# EAGLE schematic deneme4 (EAGLE 9.6.2)
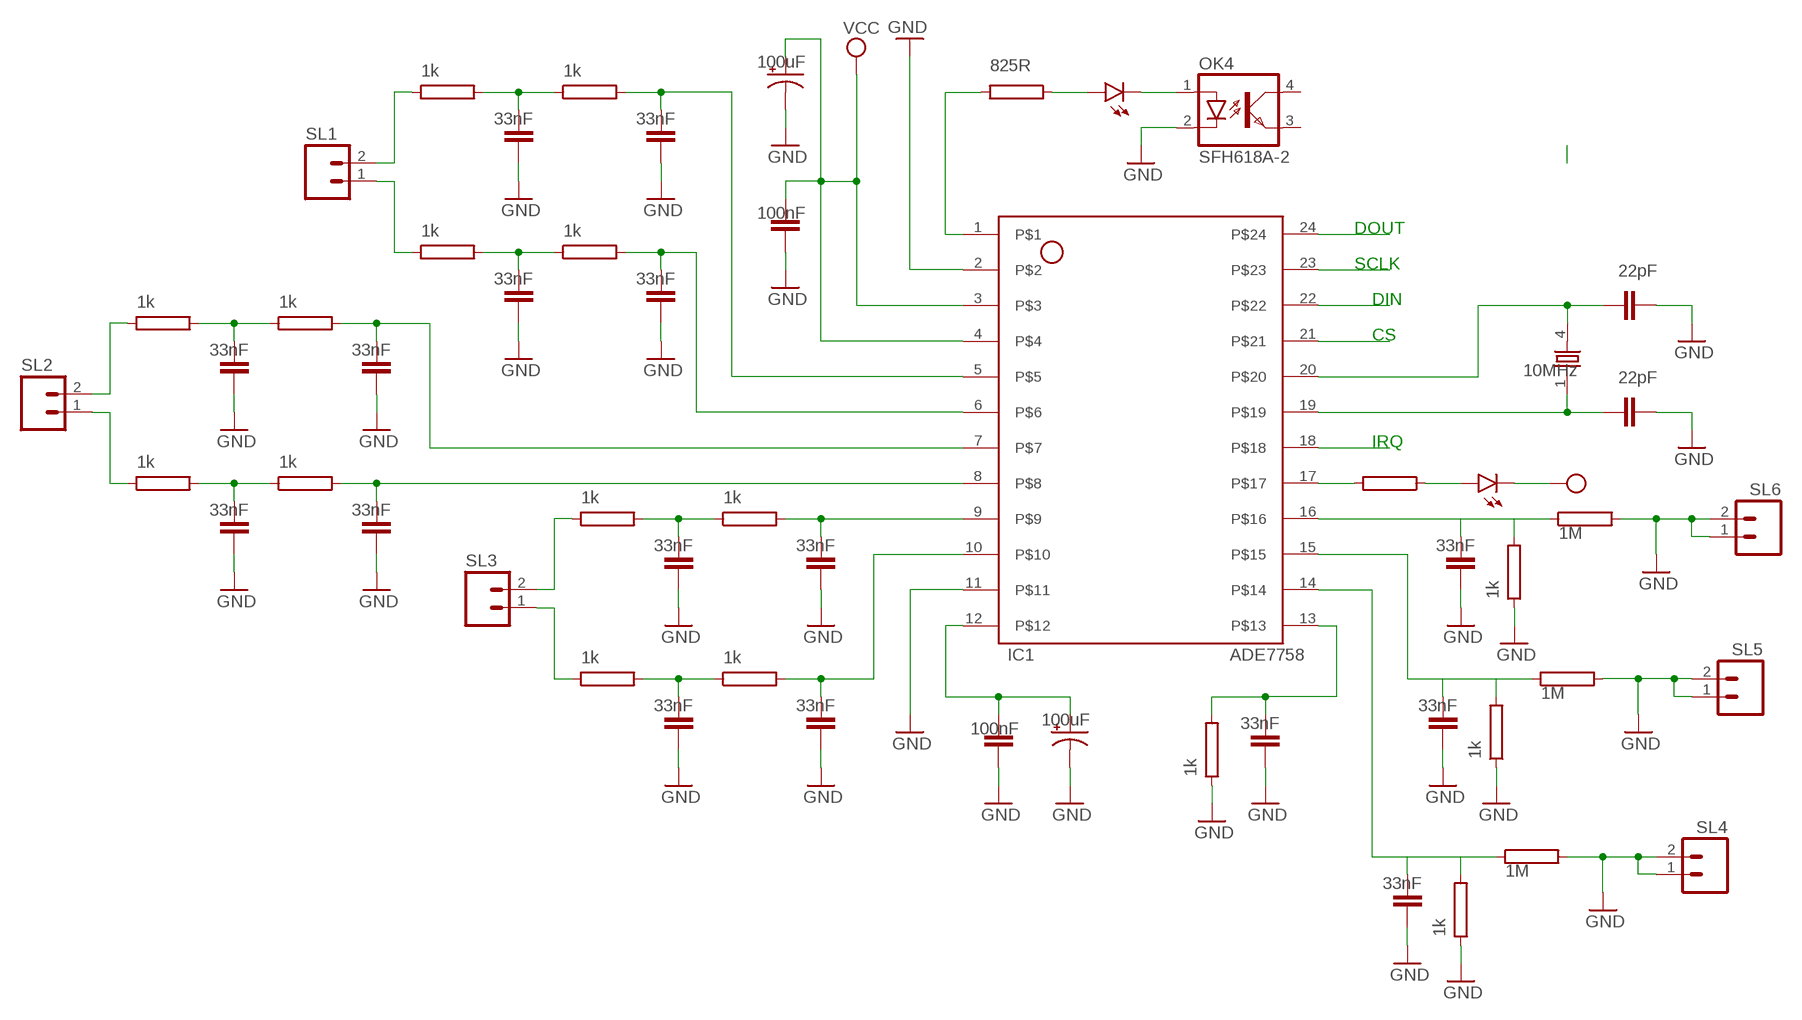
[diagram p0: schematic, sheet 1]

## Parts
C1  100nF  C2,5-3  [C2.5-3]
C2  33nF  C2,5-3  [C2.5-3]
C4  33nF  C2,5-3  [C2.5-3]
C5  33nF  C2,5-3  [C2.5-3]
C6  33nF  C2,5-3  [C2.5-3]
C7  33nF  C2,5-3  [C2.5-3]
C8  22pF  C2,5-3  [C2.5-3]
C9  22pF  C2,5-3  [C2.5-3]
C14  100uF  CPOL-US085CS-1AR  [085CS_1AR]
C16  33nF  C2,5-3  [C2.5-3]
C17  33nF  C2,5-3  [C2.5-3]
C18  33nF  C2,5-3  [C2.5-3]
C19  33nF  C2,5-3  [C2.5-3]
C20  33nF  C2,5-3  [C2.5-3]
C21  33nF  C2,5-3  [C2.5-3]
C22  33nF  C2,5-3  [C2.5-3]
C23  100uF  CPOL-US085CS-1AR  [085CS_1AR]
C24  100nF  C2,5-3  [C2.5-3]
C25  33nF  C2,5-3  [C2.5-3]
C26  33nF  C2,5-3  [C2.5-3]
C27  33nF  C2,5-3  [C2.5-3]
C28  33nF  C2,5-3  [C2.5-3]
IC1  ADE7758  [ADE7758ARWZ]
LED1  LAP4-BOTTOM  [P47F-BOTTOM]
LED2  LAP4-BOTTOM  [P47F-BOTTOM]
OK4  SFH618A-2  [DIP4]
Q1  10MHz  86SMX  [86SMX]
R1  825R  RMG100-V  [TO-247-2V]
R2  1k  RMG100-V  [TO-247-2V]
R3  1k  RMG100-V  [TO-247-2V]
R4  1k  RMG100-V  [TO-247-2V]
R5  1k  RMG100-V  [TO-247-2V]
R6  1k  RMG100-V  [TO-247-2V]
R7  1k  RMG100-V  [TO-247-2V]
R8  1k  RMG100-V  [TO-247-2V]
R9  1k  RMG100-V  [TO-247-2V]
R10  1k  RMG100-V  [TO-247-2V]
R11  1k  RMG100-V  [TO-247-2V]
R12  1k  RMG100-V  [TO-247-2V]
R13  1k  RMG100-V  [TO-247-2V]
R14  1k  RMG100-V  [TO-247-2V]
R15  1k  RMG100-V  [TO-247-2V]
R16  1M  RMG100-V  [TO-247-2V]
R17  1k  RMG100-V  [TO-247-2V]
R18  1M  RMG100-V  [TO-247-2V]
R19  1k  RMG100-V  [TO-247-2V]
R20  1M  RMG100-V  [TO-247-2V]
R21  825R  RMG100-V  [TO-247-2V]
SL1  M02  [02P]
SL2  M02  [02P]
SL3  M02  [02P]
SL4  M02  [02P]
SL5  M02  [02P]
SL6  M02  [02P]

## Nets
GND: C1.1 C2.2 C4.2 C5.2 C6.2 C7.2 C8.2 C9.2 C14.- C16.2 C17.2 C18.2 C19.2 C20.2 C21.2 C22.2 C23.- C24.1 C25.2 C26.2 C27.2 C28.2 IC1.2 IC1.11 OK4.2(C) R14.1 R15.1 R16.2 R17.1 R18.2 R19.1 R20.2 SL4.1 SL4.2 SL5.1 SL5.2 SL6.1 SL6.2
N$1: IC1.1 R1.2
N$2: LED1.A R1.1
N$3: LED1.C OK4.1(A)
N$5: C18.1 R4.1 R5.2
N$6: C16.1 R2.1 R3.2
N$7: C20.1 R6.1 R7.2
N$8: C2.1 IC1.5 R2.2
N$9: C17.1 IC1.6 R4.2
N$10: C4.1 IC1.13 R14.2
N$11: C22.1 R8.1 R9.2
N$12: C21.1 IC1.8 R8.2
N$13: C23.+ C24.2 IC1.12
N$14: C26.1 R10.1 R11.2
N$15: C19.1 IC1.7 R6.2
N$16: C28.1 R12.1 R13.2
N$17: IC1.18
N$18: C25.1 IC1.9 R10.2
N$19: C27.1 IC1.10 R12.2
N$20: IC1.15 R16.1
N$21: C5.1
N$22: R15.2
N$23: IC1.14 R18.1
N$24: C6.1
N$25: R17.2
N$26: IC1.16 R20.1
N$27: C7.1
N$28: R19.2
N$29: IC1.17 R21.2
N$30: LED2.A R21.1
N$32: IC1.21
N$33: IC1.22
N$34: IC1.23
N$35: IC1.24
N$36: C9.1 IC1.20 Q1.4
N$37: C8.1 IC1.19 Q1.1
N$38: R3.1 SL1.2
N$39: R5.1 SL1.1
N$40: R7.1 SL2.2
N$41: R9.1 SL2.1
N$42: R11.1 SL3.2
N$43: R13.1 SL3.1
VCC: C1.2 C14.+ IC1.3 IC1.4 LED2.C
Unconnected: OK4.3(EMIT) OK4.4(COL)

## Notes on the sheet
- DOUT
- SCLK
- DIN
- CS
- IRQ

## Library data of the parts
C1 C2 C4-C9 C16-C22 C24-C28 = capacitor-wima:C: CAPACITOR naming: grid - package width
C14 C23 = rcl:CPOL-US: POLARIZED CAPACITOR, American symbol; SPICEPREFIX: C
IC1 = ADE7758:ADE7758: Check prices <https://pricing.snapeda.com/parts/ADE7758/ADI%20Electronics/view-part?ref=eda>; AVAILABILITY: Bad; DESCRIPTION: Data Acquisition ADCs/DACs - Specialized 3 Phase Energy Mtr IC w/per phase; MF: ADI Electronics; MP: ADE7758; PACKAGE: SOIC-24 Analog Devices; PRICE: None
LED1 LED2 = led:*P4: PointLED® Enhanced Thinfilm LED TOP & BOTTOM mount LS P47F, LR P47F, LA P47F, LY P47F, LT P4SG, LB P4SG, LW P4SG Source: http://catalog.osram-os.com .. LA_LR_LS_LY_P47F_Pb_free.pdf
OK4 = optocoupler:SFH618?*: Optocoupler, Phototransistor Output, Low Input Current Source: Data sheet <http://www.vishay.com/docs/83673/sfh618.pdf>; MF: VISHAY/TELEFUNKEN; MPN: SFH618A-2; OC_FARNELL: 6424855; OC_NEWARK: 21H7744
Q1 = crystal:86SMX: CRYSTAL; MF: C-MAC FREQUENCY PRODUCTS LTD; MPN: XTAL003321- 86SMX; OC_FARNELL: 6344914; OC_NEWARK: 01H9866
R1-R21 = resistor-power:RMG100: TO-247 Power Resistor - RMG 100 Series Source: www.token.com.tw .. power-resistor-rmg100pdf; OC_FARNELL: unknown; OC_NEWARK: unknown
SL1-SL6 = con-amp-quick:M02: AMP QUICK CONNECTOR; OC_FARNELL: unknown; OC_NEWARK: unknown